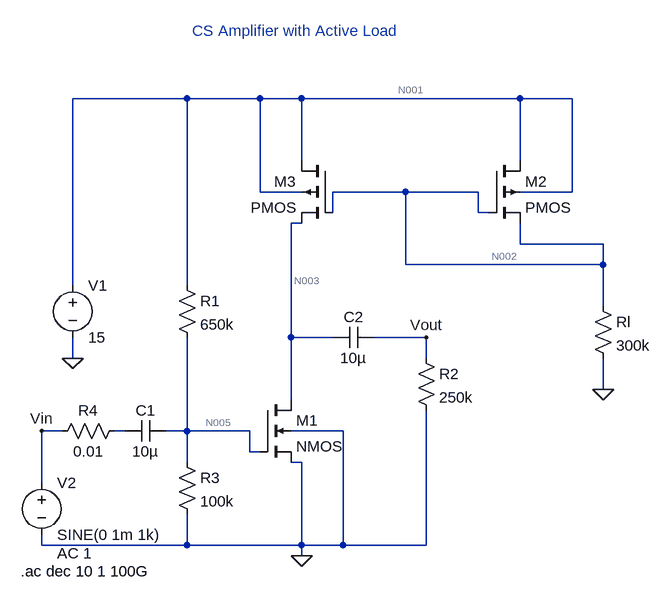
[diagram p0: schematic Experiment 12 - CS Amplifier with Active Load using FET.asc]
Experiment 12 - CS Amplifier with Active Load using FET.asc, the LTspice schematic file:
Version 4
SHEET 1 888 680
WIRE 160 -192 -16 -192
WIRE 272 -192 160 -192
WIRE 336 -192 272 -192
WIRE 672 -192 336 -192
WIRE 752 -192 672 -192
WIRE 336 -96 336 -192
WIRE 672 -96 672 -192
WIRE 272 -48 272 -192
WIRE 336 -48 272 -48
WIRE 496 -48 384 -48
WIRE 608 -48 496 -48
WIRE 752 -48 752 -192
WIRE 752 -48 672 -48
WIRE 384 -16 384 -48
WIRE 608 -16 608 -48
WIRE 624 -16 608 -16
WIRE 336 0 320 0
WIRE 672 32 672 0
WIRE 800 32 672 32
WIRE 496 64 496 -48
WIRE 800 64 800 32
WIRE 800 64 496 64
WIRE -16 96 -16 -192
WIRE 160 96 160 -192
WIRE 800 128 800 64
WIRE 320 176 320 0
WIRE 384 176 320 176
WIRE 528 176 448 176
WIRE -16 208 -16 176
WIRE 528 208 528 176
WIRE 800 256 800 208
WIRE 320 272 320 176
WIRE -32 320 -64 320
WIRE 64 320 48 320
WIRE 160 320 160 176
WIRE 160 320 128 320
WIRE 256 320 160 320
WIRE 400 320 320 320
WIRE 256 352 256 320
WIRE 272 352 256 352
WIRE 160 368 160 320
WIRE 336 368 320 368
WIRE -64 400 -64 320
WIRE -64 496 -64 480
WIRE 160 496 160 448
WIRE 160 496 -64 496
WIRE 336 496 336 368
WIRE 336 496 160 496
WIRE 400 496 400 320
WIRE 400 496 336 496
WIRE 528 496 528 288
WIRE 528 496 400 496
WIRE 336 512 336 496
FLAG -16 208 0
FLAG 336 512 0
FLAG 800 256 0
FLAG 528 176 Vout
FLAG -64 320 Vin
SYMBOL voltage -16 80 R0
WINDOW 123 0 0 Left 0
WINDOW 39 0 0 Left 0
SYMATTR InstName V1
SYMATTR Value 15
SYMBOL res 144 80 R0
SYMATTR InstName R1
SYMATTR Value 650k
SYMBOL res 512 192 R0
SYMATTR InstName R2
SYMATTR Value 250k
SYMBOL voltage -64 384 R0
WINDOW 123 24 124 Left 2
WINDOW 39 0 0 Left 0
SYMATTR Value2 AC 1
SYMATTR InstName V2
SYMATTR Value SINE(0 1m 1k)
SYMBOL cap 128 304 R90
WINDOW 0 0 32 VBottom 2
WINDOW 3 32 32 VTop 2
SYMATTR InstName C1
SYMATTR Value 10µ
SYMBOL res 784 112 R0
SYMATTR InstName Rl
SYMATTR Value 300k
SYMBOL cap 448 160 R90
WINDOW 0 0 32 VBottom 2
WINDOW 3 32 32 VTop 2
SYMATTR InstName C2
SYMATTR Value 10µ
SYMBOL res 144 352 R0
SYMATTR InstName R3
SYMATTR Value 100k
SYMBOL res 64 304 R90
WINDOW 0 0 56 VBottom 2
WINDOW 3 32 56 VTop 2
SYMATTR InstName R4
SYMATTR Value 0.01
SYMBOL nmos4 272 272 R0
SYMATTR InstName M1
SYMBOL pmos4 624 -96 R0
SYMATTR InstName M2
SYMBOL pmos4 384 -96 M0
SYMATTR InstName M3
TEXT -96 536 Left 2 !.ac dec 10 1 100G
TEXT 168 -296 Left 2 ;CS Amplifier with Active Load

The netlist it stands for:
* Experiment 12 - CS Amplifier with Active Load using FET.asc
V1 N001 0 15
R1 N001 N005 650k
R2 Vout 0 250k
V2 Vin 0 SINE(0 1m 1k) AC 1
C1 N005 N004 10µ
Rl N002 0 300k
C2 Vout N003 10µ
R3 N005 0 100k
R4 N004 Vin 0.01
M1 N003 N005 0 0 NMOS
M2 N001 N002 N002 N001 PMOS
M3 N001 N002 N003 N001 PMOS
.model NMOS NMOS
.model PMOS PMOS
.lib standard.mos
.ac dec 10 1 100G
* CS Amplifier with Active Load
.backanno
.end

* Results of the author's LTspice run, read from the files saved beside the schematic
* Operating Point, zero values left out:
*   V(n001) = 15 V
*   V(n005) = 2 V
*   V(n002) = 12.92 V
*   V(n003) = 13.48 V
*   Id(M3) = 40 µA
*   Ib(M3) = 1.53 pA
*   Is(M3) = -40 µA
*   Id(M2) = 43.08 µA
*   Ib(M2) = 2.086 pA
*   Is(M2) = -43.08 µA
*   Id(M1) = 40 µA
*   Ib(M1) = -13.49 pA
*   Is(M1) = -40 µA
*   I(R3) = 20 µA
*   I(Rl) = 43.08 µA
*   I(R1) = 20 µA
*   I(V1) = -103.1 µA
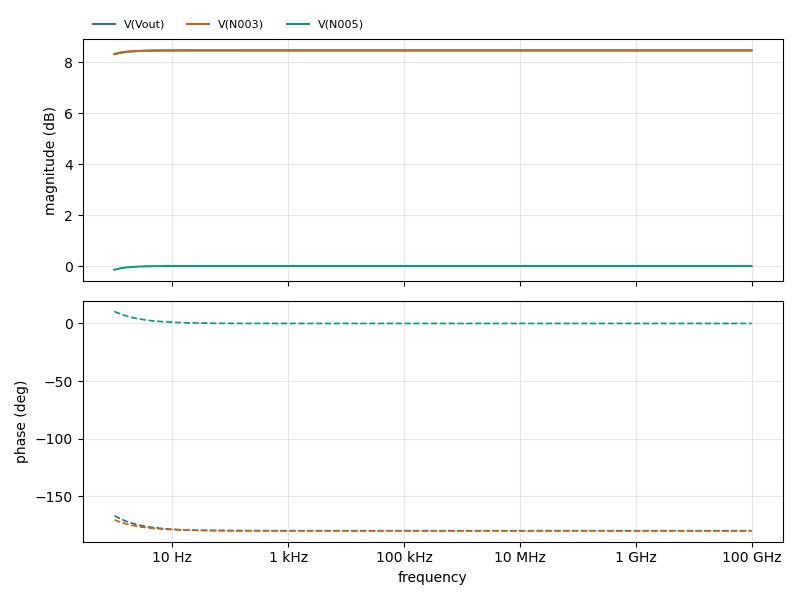
[diagram p1: AC Analysis of Experiment 12 - CS Amplifier with Active Load using FET.asc, plotted from the saved traces]
* AC Analysis, 1 run:
*   V(Vout): 8.31 dB at 1 Hz, 8.46 dB at 100 GHz, peak 8.46 dB at 158.5 MHz
*   V(N003): 8.32 dB at 1 Hz, 8.46 dB at 100 GHz, peak 8.46 dB at 158.5 MHz
*   V(N005): -0.14 dB at 1 Hz, -0.00 dB at 100 GHz, peak -0.00 dB at 7.943 GHz